# EAGLE design Moteino (EAGLE 7.3.0)
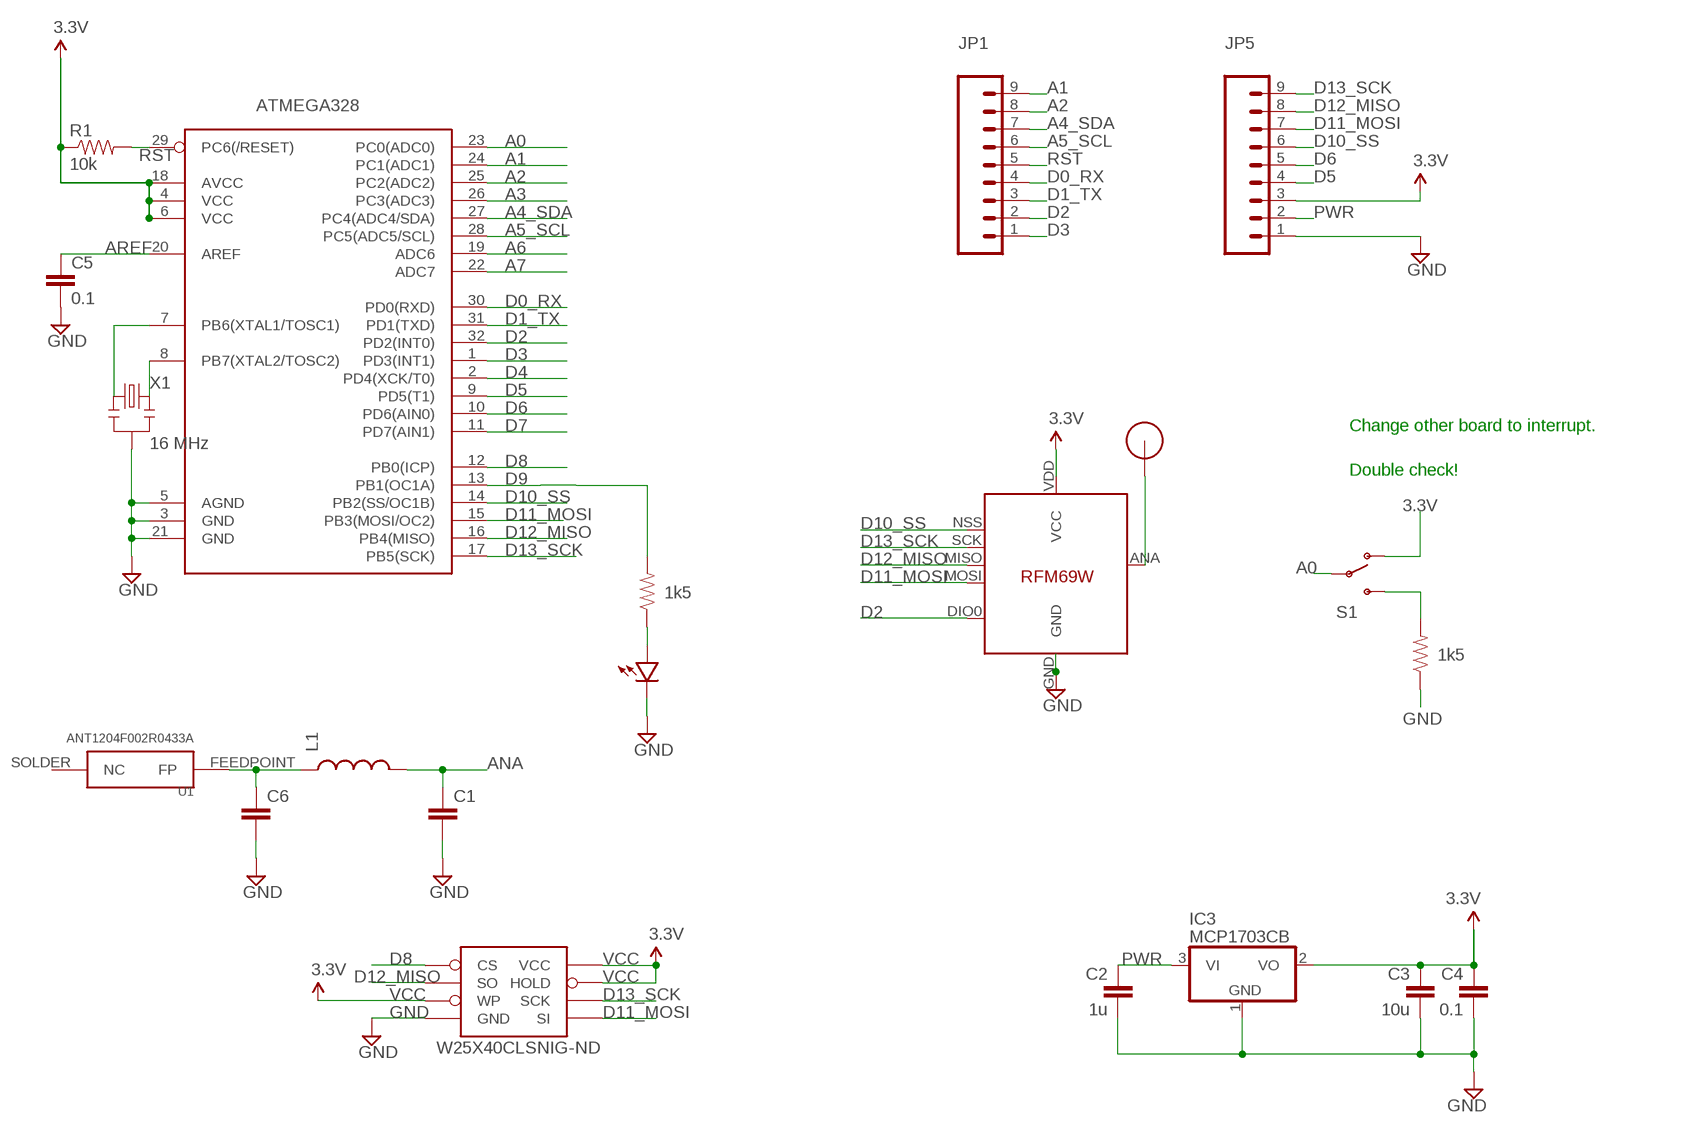
[diagram p0: schematic, sheet 1]

## Parts
ATMEGA328  ATMega-328  ATMEGA168/328TQFP32  [TQFP32-08]
C1  CAP0603-CAP  [0603-CAP]
C2  1u  CAP0603-CAP  [0603-CAP]
C3  10u  CAP0805-CAP  [0805-CAP]
C4  0.1  CAP0603-CAP  [0603-CAP]
C5  0.1  CAP0603-CAP  [0603-CAP]
C6  CAP0603-CAP  [0603-CAP]
IC3  MCP1703CB  [SOT23]
JP1  M09  [1X09]
JP5  M09  [1X09]
L1  INDUCTOR0603  [0603]
R1  10k  RESISTOR0603-RES  [0603-RES]
R2  1k5  RESISTOR0603-RES  [0603-RES]
R3  1k5  RESISTOR0603-RES  [0603-RES]
S1  SWITCH-SPDT-SMD-A  [SWITCH-SPST-SMD-A]
U1  ANT1204F002R0433A  [ANT1204F002R0433A]
U$1  RFM12B_ANTENNA  [RFM12B-ANTENNA]
U$2  LED0603  [0603-LED]
U$5  RFM69  [RFM69W-MINPADS]
W25X40CLSNIG-ND  AT25F512BWIDE_5.3MM  [SO08WIDE]
X1  16 MHz  RESONATORSMD  [RESONATOR-SMD]

## Nets
3.3V: S1.1(O)
A0: ATMEGA328.23(PC0(ADC0)) S1.2(P)
A1: ATMEGA328.24(PC1(ADC1)) JP1.9
A2: ATMEGA328.25(PC2(ADC2)) JP1.8
A3: ATMEGA328.26(PC3(ADC3))
A4_SDA: ATMEGA328.27(PC4(ADC4/SDA)) JP1.7
A5_SCL: ATMEGA328.28(PC5(ADC5/SCL)) JP1.6
A6: ATMEGA328.19(ADC6)
A7: ATMEGA328.22(ADC7)
ANA: C1.1 L1.2 U$1.P$1 U$5.ANA(ANT)
AREF: ATMEGA328.20(AREF) C5.1
D0_RX: ATMEGA328.30(PD0(RXD)) JP1.4
D1_TX: ATMEGA328.31(PD1(TXD)) JP1.3
D2: ATMEGA328.32(PD2(INT0)) JP1.2 U$5.DIO0
D3: ATMEGA328.1(PD3(INT1)) JP1.1
D4: ATMEGA328.2(PD4(XCK/T0))
D5: ATMEGA328.9(PD5(T1)) JP5.4
D6: ATMEGA328.10(PD6(AIN0)) JP5.5
D7: ATMEGA328.11(PD7(AIN1))
D8: ATMEGA328.12(PB0(ICP)) W25X40CLSNIG-ND.1(CS)
D9: ATMEGA328.13(PB1(OC1A)) R2.2
D10_SS: ATMEGA328.14(PB2(SS/OC1B)) JP5.6 U$5.NSS(SEL)
D11_MOSI: ATMEGA328.15(PB3(MOSI/OC2)) JP5.7 U$5.MOSI W25X40CLSNIG-ND.5(SI)
D12_MISO: ATMEGA328.16(PB4(MISO)) JP5.8 U$5.MISO W25X40CLSNIG-ND.2(SO)
D13_SCK: ATMEGA328.17(PB5(SCK)) JP5.9 U$5.SCK W25X40CLSNIG-ND.6(SCK)
GND [power]: ATMEGA328.3(GND) ATMEGA328.5(AGND) ATMEGA328.21(GND) C1.2 C2.2 C3.2 C4.2 C5.2 C6.2 IC3.1(GND) JP5.1 R3.1 U$2.MINUS U$5.GND W25X40CLSNIG-ND.4(GND) X1.2
N$1: ATMEGA328.7(PB6(XTAL1/TOSC1)) X1.1
N$2: R2.1 U$2.PLUS
N$4: R3.2 S1.3(S)
N$5: C6.1 L1.1 U1.FEEDPOINT(FP)
N$21: ATMEGA328.8(PB7(XTAL2/TOSC2)) X1.3
PWR [power]: C2.1 IC3.3(VI) JP5.2
RST: ATMEGA328.29(PC6(/RESET)) JP1.5 R1.2
VCC: ATMEGA328.4(VCC) ATMEGA328.6(VCC) ATMEGA328.18(AVCC) C3.1 C4.1 IC3.2(VO) JP5.3 R1.1 U$5.VDD(VCC) W25X40CLSNIG-ND.3(WP) W25X40CLSNIG-ND.7(HOLD) W25X40CLSNIG-ND.8(VCC) ; supply symbol labelled 3.3V
Unconnected: U1.SOLDER(NC)

## Notes on the sheet
- Change other board to interrupt.
- Double check!

## Library data of the parts
ATMEGA328 = LowPowerLab:ATMEGA168/328: Atmel 32-pin 8-bit micro, 16k flash.
C1 C6 = SparkFun-Passives:CAP: Capacitor Standard 0603 ceramic capacitor, and 0.1" leaded capacitor.
C2-C5 = LowPowerLab:CAP: Capacitor Standard 0603 ceramic capacitor, and 0.1" leaded capacitor.
IC3 = linear:MCP1703: 250 mA, 16V, Low Quiescent Current LDO Regulator Source: http://ww1.microchip.com/downloads/en/DeviceDoc/22049b.pdf
JP1 JP5 = SparkFun-Connectors:M09: Header 9 Standard 9-pin 0.1" header. Use with straight break away headers (SKU : PRT-00116), right angle break away headers (PRT-00553), swiss pins (PRT-00743), machine pins (PRT-00117), and female headers (PRT-00115).
L1 = SparkFun-Passives:INDUCTOR: Inductors Basic Inductor/Choke - 0603 and 1206. Footprints are not proven and vary greatly between part numbers. INDUCTOR POWER 3.3UH 4.0A SMD 0.197" L x 0.197" W x 0.177" H (5.00mm x 5.00mm x 4.50mm)
R1-R3 = LowPowerLab:RESISTOR: Resistor Basic schematic elements and footprints for 0603, 1206, and PTH resistors.
S1 = SparkFun-Electromechanical:SWITCH-SPDT: SPDT Switch Simple slide switch, Spark Fun Electronics SKU : COM-00102 DPDT SMT slide switch, AYZ0202, SWCH-08179
U1 = TestLibrary:ANT1204F002R0433A: ANT1204F002R0433A http://www.yageo.com/documents/recent/An_SMD_UHF_433_1204_0.pdf
U$1 = LowPowerLab:RFM12B_ANTENNA
U$2 = LowPowerLab:LED
U$5 = LowPowerLab:RFM69
W25X40CLSNIG-ND = LowPowerLab:AT25F512B: 4-Mbit SPI flash memory
X1 = SparkFun:RESONATOR: Resonator Small SMD resonator. This is the itty bitty 10/20MHz resonators with built in caps. CSTCE10M0G55 and CSTCE20M0V53. Footprint has been reviewed closely but hasn't been tested yet.

## Board
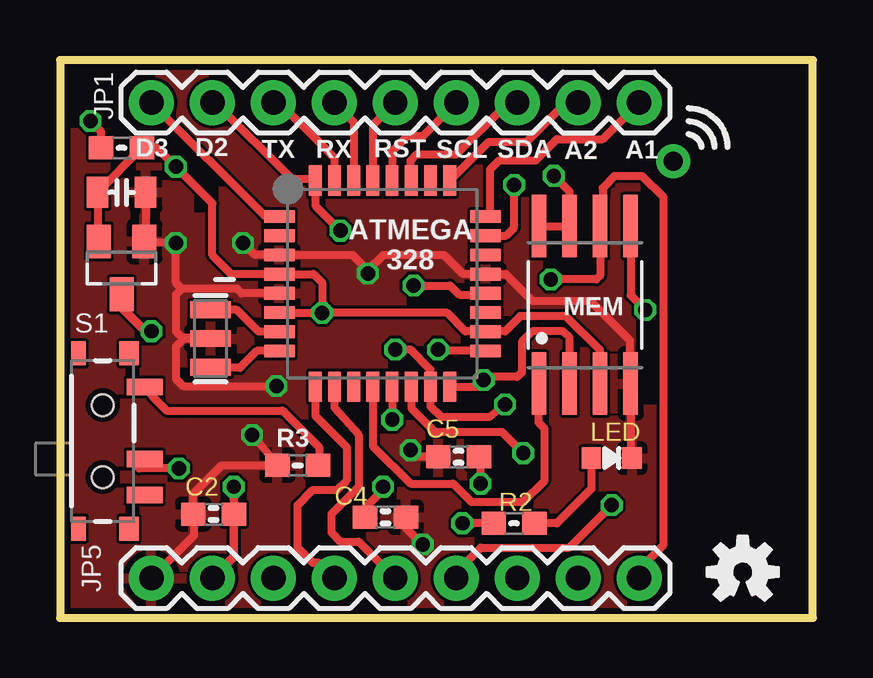
[diagram p1: board, top side]
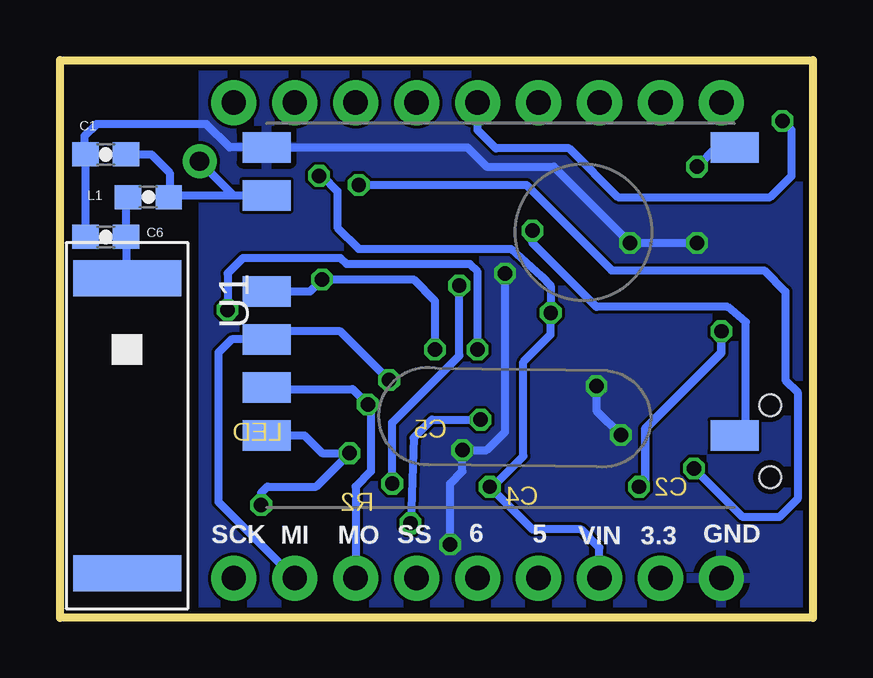
[diagram p2: board, bottom side, seen from below]

Size 31.37 x 23.24 mm. Coordinates in mm from the lower left corner, seen from the top.
Outline: 0,0 31.37,0 31.37,23.24 0,23.24 0,0
Copper layers (1*16): Top 0.035mm / dielectric 1.5mm / Bottom 0.035mm
Design rules "dirt_cheap_dirty_boards.v1": minimum track width 5mil, minimum drill 12mil, track to track 5mil, track to pad 5mil, pad to pad 5mil, via to via 5mil, smd to smd 0mil, copper to edge 10mil, drill to drill 10mil, minimum pad ring 10mil, minimum via ring 6mil, stop-mask expansion 2mil, vias tented up to drill 25mil, thermal gap 10mil
tRestrict: area 24,8.9 to 28.8,12.8; area 5.6,16.9 to 6.6,18.5; area 5,9.7 to 6.5,10.4
bRestrict: area 27.2,17.7 to 29,18.7; area 20.8,13.8 to 22.6,14.9; area 21.3,12.6 to 21.8,13.2; area 20.4,12.6 to 21,13.2; area 19.9,12.8 to 20.4,13.5; area 19.9,13.4 to 20.4,14; area 26.3,18.9 to 26.8,19.5; area 26.3,17.9 to 26.8,18.5; area 27.3,19.1 to 27.8,19.8; area 27.7,18.8 to 28.8,19.6

### Footprints (pad centres in the part's own frame; a part is rotated, then mirrored left to right if it is on the bottom)
TQFP32-08 = smd 1.27 x 0.533: 1 -4.293,2.8; 2 -4.293,2; 3 -4.293,1.2; 4 -4.293,0.4; 5 -4.293,-0.4; 6 -4.293,-1.2; 7 -4.293,-2; 8 -4.293,-2.8; 17 4.293,-2.8; 18 4.293,-2; 19 4.293,-1.2; 20 4.293,-0.4; 21 4.293,0.4; 22 4.293,1.2; 23 4.293,2; 24 4.293,2.8 | smd 0.533 x 1.27: 9 -2.8,-4.293; 10 -2,-4.293; 11 -1.2,-4.293; 12 -0.4,-4.293; 13 0.4,-4.293; 14 1.2,-4.293; 15 2,-4.293; 16 2.8,-4.293; 25 2.8,4.293; 26 2,4.293; 27 1.2,4.293; 28 0.4,4.293; 29 -0.4,4.293; 30 -1.2,4.293; 31 -2,4.293; 32 -2.8,4.293
0603-CAP = smd 1.1 x 1: 1 -0.85,0; 2 0.85,0
0603-CAP' = smd 1.016 x 0.965: 1 -0.85,0; 2 0.85,0
0805-CAP = smd 0.902 x 1.3: 1 -1,0; 2 1,0
SOT23 = smd 1 x 1.4: 1 -0.95,-1.1; 2 0.95,-1.1; 3 0,1.1
1X09 = drill 1.016 pad 1.88: 1 0,0; 2 2.54,0; 3 5.08,0; 4 7.62,0; 5 10.16,0; 6 12.7,0; 7 15.24,0; 8 17.78,0; 9 20.32,0
0603 = smd 1.1 x 1: 1 -0.85,0; 2 0.85,0
0603-RES = smd 1.016 x 0.965: 1 -0.85,0; 2 0.85,0
SWITCH-SPST-SMD-A = smd 0.7 x 1.5: 1 -2.25,-1.75; 2 -0.75,-1.75; 3 2.25,-1.75 | smd 1 x 0.6: GND1 -3.65,1; GND3 3.65,1 | smd 1 x 0.8: GND2 -3.65,-1.1; GND4 3.65,-1.1 | hole 0.9: -1.5,0; 1.5,0
ANT1204F002R0433A = smd 1.5 x 4.5: FEEDPOINT -6.15,0; SOLDER 6.15,0
RFM12B-ANTENNA = drill 0.8 pad 1.422: P$1 0,0
0603-LED = smd 0.8 x 0.9: MINUS -0.85,0; PLUS 0.85,0
RFM69W-MINPADS = smd 2 x 1.27: ANA 8,-5; DIO0 -11.5,5; GND 8,-7; MISO 8,1; MOSI 8,3; NSS 8,5; SCK 8,-1; VDD -11.5,-7
SO08WIDE = smd 0.61 x 2.6: 1 -1.905,-3.269; 2 -0.635,-3.269; 3 0.635,-3.269; 4 1.905,-3.269; 5 1.905,3.286; 6 0.635,3.286; 7 -0.635,3.286; 8 -1.905,3.286
RESONATOR-SMD = smd 0.7 x 1.7: 1 -1.2,0; 2 0,0; 3 1.2,0

### Placement (x,y rotation side)
ATMEGA328  13.44,13.92 0 top
C1  29.46,19.3 180 bottom
C2  1u  [0603-CAP']  6.4,4.32 180 top
C3  2.57,17.73 0 top
C4  0.1  [0603-CAP']  13.56,4.19 0 top
C5  0.1  [0603-CAP']  16.61,6.71 180 top
C6  29.46,15.88 180 bottom
IC3  2.57,14.58 180 top
JP1  3.81,21.46 0 top
JP5  3.81,1.65 0 top
L1  27.69,17.53 0 bottom
R1  2.57,19.58 180 top
R2  18.92,3.94 180 top
R3  9.91,6.35 0 top
S1  1.78,7.37 90 top
U1  28.57,8 270 bottom
U$1  25.55,19.02 0 top
U$2  22.99,6.65 180 top
U$3  [OSHW-LOGO-S]  28.45,1.91 0 top
U$5  14.76,12.6 180 bottom
W25X40CLSNIG-ND  21.87,13.03 0 top
X1  6.27,11.63 270 top

### Tracks (layer width: path | path; a pad name or v marks a point on that pad's centre or on a via)
A0  (via drill 0.6)
  Top 0.33: ATMEGA328.23 18.59,15.92 18.92,16.26 v18.92,18.03 | v4.95,6.22 3.29,6.22 S1.2
  Bottom 0.33: v18.92,18.03 11.94,18.03 8.38,14.48 2.03,14.48 1.14,13.59 1.14,9.91 0.64,9.4 0.64,4.95 1.4,4.19 2.92,4.19 v4.95,6.22
A1
  Top 0.33: ATMEGA328.24 17.91,16.9 17.91,18.67 18.29,19.05 19.81,19.05 20.7,19.94 22.61,19.94 JP1.9
A2
  Top 0.33: JP1.8 21.08,21.46 19.43,19.81 17.84,19.81 ATMEGA328.25 16.31,18.29
A4_SDA
  Top 0.33: ATMEGA328.27 14.61,18.24 14.61,19.05 14.86,19.3 16.51,19.3 18.54,21.34 | 18.54,21.34 18.41,21.34 | 18.54,21.34 18.92,21.34 JP1.7
A5_SCL
  Top 0.33: ATMEGA328.28 13.84,19.43 14.48,20.07 15.11,20.07 JP1.6
ANA
  Bottom 0.33: 24.15,17.6 26.76,17.6 L1.2 26.8,17.57 26.8,18.54 27.56,19.3 C1.1 | 24.15,17.6 U$5.ANA | U$1.P$1 25.42,18.87 24.15,17.6
AREF  (via drill 0.6)
  Top 0.33: v17.53,5.59 17.53,6.64 C5.1 | v14.73,13.84 16.26,13.84 16.64,13.46 17.67,13.46 ATMEGA328.20
  Bottom 0.33: v17.53,5.59 17.53,8.13 14.73,10.92 v14.73,13.84
D0_RX
  Top 0.33: JP1.4 12.24,20.66 ATMEGA328.30
D1_TX
  Top 0.33: ATMEGA328.31 11.44,19.18 10.8,19.81 10.79,19.81 9.14,21.46 JP1.3
D2  (via drill 0.6)
  Top 0.33: JP1.2 6.48,21.46 9.65,18.29 10.56,18.29 ATMEGA328.32 10.64,17.18 v11.68,16.13
  Bottom 0.33: U$5.DIO0 2.79,7.87 2.79,12.32 3.56,12.95 9.02,12.95 11.68,15.62 v11.68,16.13
D3
  Top 0.33: JP1.1 8.51,16.76 9.1,16.76 ATMEGA328.1
D5
  Top 0.33: ATMEGA328.9 10.64,8.41 11.94,7.11 11.94,5.71 11.56,5.33 10.54,5.33 9.91,4.7 9.91,2.92 10.54,2.29 10.79,2.29 JP5.4
D6
  Top 0.33: ATMEGA328.10 11.44,8.76 12.45,7.62 12.45,5.46 11.3,4.32 11.3,3.56 11.68,3.17 12.45,3.17 JP5.5
D8
  Top 0.33: ATMEGA328.12 13.04,7.16 14.61,5.59 16.38,5.59 17.14,4.83 19.3,4.83 20.19,5.71 20.19,7.87 19.94,8.13 19.94,9.74 W25X40CLSNIG-ND.1
D9  (via drill 0.6)
  Top 0.33: ATMEGA328.13 13.84,8.52 v13.84,8.26 | R2.2 v16.76,3.94
  Bottom 0.33: v16.76,3.94 16.64,7.49 15.88,8.26 v13.84,8.26
D10_SS  (via drill 0.6)
  Top 0.33: JP5.6 16.51,1.91 17.53,2.92 21.21,2.92 v22.99,4.7 | ATMEGA328.14 14.64,8.73 15.62,7.75 18.41,7.75 v19.3,6.86
  Bottom 0.33: U$5.NSS 21.19,7.6 20.45,6.86 v19.3,6.86 20.7,5.46 22.73,5.46 22.99,5.21 v22.99,4.7
D11_MOSI  (via drill 0.6)
  Top 0.33: v18.54,8.89 17.91,8.38 15.88,8.38 15.44,8.82 ATMEGA328.15 15.44,10.34 14.61,11.18 v13.97,11.18 | W25X40CLSNIG-ND.5 23.77,13.44 v24.38,12.83
  Bottom 0.33: U$5.MOSI 22.68,9.53 19.18,9.53 v18.54,8.89 18.41,8.76 18.41,6.1 19.05,5.46 JP5.7 | v13.97,11.18 13.97,14.41 14.29,14.73 19.43,14.73 19.68,14.99 23.75,14.99 24.38,14.35 v24.38,12.83
D12_MISO  (via drill 0.6)
  Top 0.33: ATMEGA328.16 17.37,9.63 v17.65,9.91 17.78,10.03 19.05,10.03 19.24,10.22 19.24,11.49 19.68,11.94 20.95,11.94 21.23,11.66 W25X40CLSNIG-ND.2
  Bottom 0.33: v17.65,9.91 19.68,11.94 22.42,11.94 U$5.MISO 24.22,11.6 24.76,11.05 24.76,4.83 JP5.8
D13_SCK  (via drill 0.6)
  Top 0.33: v20.45,14.1 22.35,14.1 22.5,14.25 W25X40CLSNIG-ND.6 22.61,16.42 22.61,17.91 23.11,18.41 24.25,18.41 25.15,17.52 25.15,3.05 24.13,2.03 JP5.9 | ATMEGA328.17 15.81,11.12 v15.75,11.18
  Bottom 0.33: U$5.SCK 20.95,13.6 v20.45,14.1 16.64,14.1 15.75,13.21 v15.75,11.18
GND  (via drill 0.6)
  Top 0.33: ATMEGA328.5 7.56,13.52 7.37,13.72 5.08,13.72 | 5.08,13.72 4.83,13.46 4.83,11.94 5.08,11.68 6.22,11.68 X1.2 5.16,11.63 4.83,11.3 4.83,9.97 5.14,9.65 v9.02,9.65 | C3.2 3.56,15.73 IC3.1 3.57,15.62 v4.83,15.62 4.83,13.97 5.08,13.72 | 23.88,10.29 23.75,10.41 23.75,11.56 22.1,13.21 19.68,13.21 18.57,14.32 ATMEGA328.21 16.8,14.32 16,15.11 13.46,15.11 12.83,14.48 | 23.88,9.86 W25X40CLSNIG-ND.4 23.77,6.72 U$2.MINUS | R3.1 6.73,6.35 5.55,5.17 C2.2 5.59,4.28 5.59,3.43 JP5.1 | v7.62,15.62 8.12,15.12 ATMEGA328.3 12.19,15.12 12.83,14.48 | C5.2 14.88,6.71 v14.61,6.99 | v8,7.62 8.04,7.62 R3.1 | 9.02,6.57 R3.1 | C4.2 14.41,3.75 v15.11,3.05 | v12.83,14.35 12.83,14.48
  Bottom 0.33: v4.83,15.62 v7.62,15.62 10.79,18.8 13.59,18.8 14.39,19.6 U$5.GND 24.3,19.6 25.27,20.57 29.84,20.57 30.35,20.07 30.35,19.34 C1.2 C6.2 | v9.02,9.65 9.02,8.64 v8,7.62 | v15.11,3.05 15.11,5.59 14.61,6.1 v14.61,6.99 13.59,6.99 12.83,7.75 v12.83,14.35
  pour Bottom: 23.49,19.94 23.37,19.94 23.37,20.07
  pour Top: -0.25,23.5 24.76,23.5 arc-90 25.4,22.86 25.4,-0.13 0.38,-0.13 arc-90 -0.25,0.51 -0.25,23.37
  pour Bottom: 0.76,23.62 24.76,23.62 arc-90 25.4,22.99 25.4,-0.13 0.38,-0.13 arc-90 -0.25,0.51 -0.25,23.5 0.76,23.5
N$1
  Top 0.33: ATMEGA328.7 8.27,11.92 7.37,12.83 X1.1
N$2
  Top 0.33: U$2.PLUS 22.14,5.37 20.7,3.94 R2.1
N$4
  Top 0.33: R3.2 10.79,6.64 10.79,7.11 9.27,8.64 4.45,8.64 3.85,9.23 S1.3
N$5
  Bottom 0.33: U1.FEEDPOINT 28.61,14.19 C6.1 28.61,17.45 L1.1
N$21
  Top 0.33: ATMEGA328.8 8.2,11.12 7.49,10.41 6.29,10.41 X1.3
PWR  (via drill 0.6)
  Top 0.33: 2.56,12.93 2.54,12.95
  Top 0.356: JP5.2 7.24,2.54 7.24,4.31 C2.1 v7.24,5.46 | IC3.3 2.56,12.93 | 2.54,12.95 3.68,11.81 v3.81,11.94
  Bottom 0.356: v7.24,5.46 6.98,5.71 6.98,7.87 3.81,11.05 v3.81,11.94
RST  (via drill 0.6)
  Top 0.33: JP1.5 13.04,20.53 ATMEGA328.29 | R1.2 1.72,20.26 v1.27,20.7
  Bottom 0.33: JP1.5 13.97,20.32 13.21,19.56 10.16,19.56 8.13,17.53 1.78,17.53 0.89,18.41 0.89,20.32 v1.27,20.7
VCC  (via drill 0.6)
  Top 0.33: W25X40CLSNIG-ND.8 W25X40CLSNIG-ND.7 | 9.16,12.7 ATMEGA328.6 10.9,12.72 v10.92,12.7 | IC3.2 1.56,15.73 C3.1 R1.1 4.04,19.58 v4.83,18.8 6.35,17.27 6.35,15.11 7.14,14.32 ATMEGA328.4 10.57,14.32 10.92,13.97 v10.92,12.7 | W25X40CLSNIG-ND.3 22.5,11.15 21.08,12.57 19.18,12.57 18.54,11.94 17.75,11.94 ATMEGA328.18 17.71,11.94 16.89,11.94 16.13,12.7 v10.92,12.7 | W25X40CLSNIG-ND.7 21.23,17.5 | v13.46,5.46 13.46,5.33 12.7,4.57 12.7,4.21 C4.1 | W25X40CLSNIG-ND.7 21.23,17.75 v20.57,18.41
  Bottom 0.33: U$5.VDD 4.02,19.6 v4.83,18.8 | 8.89,2.54 JP5.3 8.89,2.92 9.65,3.68 11.68,3.68 v13.46,5.46 | v13.46,5.46 13.34,5.46 12.07,6.73 12.07,10.67 10.92,11.81 v10.92,12.7 10.92,13.84 11.3,14.22 12.57,15.37 18.92,15.37 19.81,16.26 19.81,17.78 20.45,18.41 v20.57,18.41 | 13.21,5.21 v13.46,5.46

### Text on the board
Dimension: C5 | LED | C2 | C4 | R2
bPlace: GND | 3.3 | VIN | 5 | 6 | SS | MO | MI | SCK
tDocu: REG
_tsilk: D3 | D2 | TX | RX | A2 | A1 | RST | SCL | SDA | ATMEGA / 328 | MEM